# Altium schematic sheet PolarizacionBJT.SchDoc
size A4; SheetNumber: 1; SheetTotal: 1
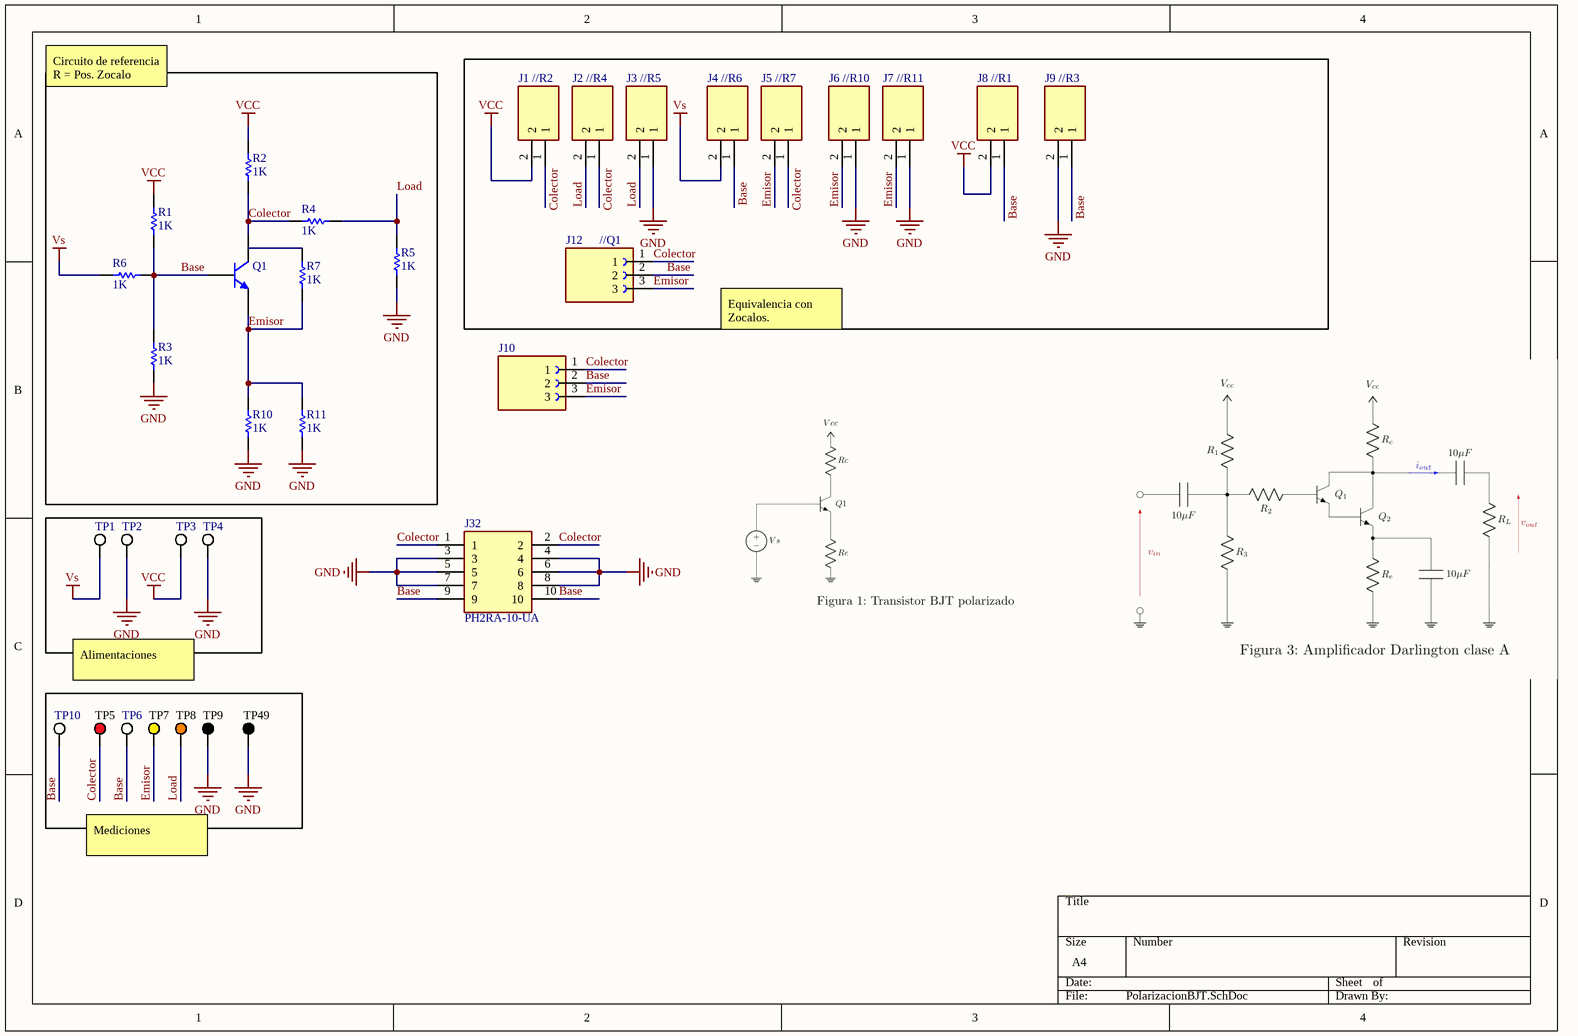
[diagram p0: PolarizacionBJT.SchDoc]

## Parts
J1  D01-9970242  [D019970242]  (value not drawn)
J2  D01-9970242  [D019970242]  (value not drawn)
J3  D01-9970242  [D019970242]  (value not drawn)
J4  D01-9970242  [D019970242]  (value not drawn)
J5  D01-9970242  [D019970242]  (value not drawn)
J6  D01-9970242  [D019970242]  (value not drawn)
J7  D01-9970242  [D019970242]  (value not drawn)
J8  D01-9970242  [D019970242]  (value not drawn)
J9  D01-9970242  [D019970242]  (value not drawn)
J10  D01-9970342  [HARWIN_D01-9970342]  (value not drawn)
J12  D01-9970342  [HARWIN_D01-9970342]  (value not drawn)
J32  PH2RA-10-UA  [HDRRA10W64P254_2X5_1270X250X538P]
Q1  Bipolar NPN 3 Pins Transistor VBIC Model  (value not drawn)
R1  value 1K  (hidden comment: Resistor)
R2  value 1K  (hidden comment: Resistor)
R3  value 1K  (hidden comment: Resistor)
R4  value 1K  (hidden comment: Resistor)
R5  value 1K  (hidden comment: Resistor)
R6  value 1K  (hidden comment: Resistor)
R7  value 1K  (hidden comment: Resistor)
R10  value 1K  (hidden comment: Resistor)
R11  value 1K  (hidden comment: Resistor)
TP1  575-4  [KSTN-575-4]  (value not drawn)
TP2  575-4  [KSTN-575-4]  (value not drawn)
TP3  575-4  [KSTN-575-4]  (value not drawn)
TP4  575-4  [KSTN-575-4]  (value not drawn)
TP5  5010  [KSTN-5010_V]  (value not drawn)
TP6  5012  [KSTN-5012_V]  (value not drawn)
TP7  5014  [KSTN-5014_V]  (value not drawn)
TP8  5013  [KSTN-5013_V]  (value not drawn)
TP9  5011  [KSTN-5011_V]  (value not drawn)
TP10  5012  [KSTN-5012_V]  (value not drawn)
TP49  5011  [KSTN-5011_V]  (value not drawn)

## Nets
GND: J3.1 J6.1 J7.1 J9.2 J32.3 J32.4 J32.5 J32.6 J32.7 J32.8 R3.1 R5.2 R10.2 R11.2 TP2.1 TP4.1 TP9.1 TP49.1
VCC: J1.2 J8.2 R1.2 R2.1 TP3.1
Vs: J4.2 R6.2 TP1.1
Base: J4.1 J8.1 J9.1 J10.2 J12.2 J32.9 J32.10 Q1.2(B) R1.1 R3.2 R6.1 TP6.1 TP10.1
Colector: J1.1 J2.1 J5.1 J10.1 J12.1 J32.1 J32.2 Q1.1(C) R2.2 R4.2 TP5.1
Emisor: J5.2 J6.2 J7.2 J10.3 J12.3 Q1.3(E) R7.2 R10.1 R11.1 TP7.1
Load: J2.2 J3.2 R4.1 R5.1 TP8.1

Not connected (* = marked no-connect by the designer): R7 1

## Notes on the sheet
- Circuito de referencia
  R = Pos. Zocalo
- //R2
- //R4
- //R5
- //R6
- //R7
- //R10
- //R11
- //R1
- //R3
- (near J12) //Q1
- Equivalencia con Zocalos.
- Alimentaciones
- Mediciones

## Library data of the parts
J1-J9 = D01-9970242: IC Socket: 2 Pos Receptacle SIL Straight THT Strip; Manufacturer_Name: Harwin; Geometry.Height: 4.2mm; Mouser Part Number: 855-D01-9970242; Mouser Price/Stock: https://www.mouser.co.uk/ProductDetail/Harwin/D01-9970242?qs=TpUtqFO9vU%252Bf37OJ5TYoTQ%3D%3D; Manufacturer_Part_Number: D01-9970242; Datasheet Link: https://content.harwin.com/m/e0b6c35948424a73/original/DRG-00097-Technical-Drawing-Datasheet-D01-997-pdf.pdf
J32 = PH2RA-10-UA: CONN HEADER R/A 10POS 2.54MM; Manufacturer_Name: Adam Tech; Geometry.Height: 5.381mm; Mouser Part Number: 737-PH2RA-10-UA; Mouser Price/Stock: https://www.mouser.co.uk/ProductDetail/Adam-Tech/PH2RA-10-UA?qs=HoCaDK9Nz5eXic%252Bmj6sc5g%3D%3D; Manufacturer_Part_Number: PH2RA-10-UA; Datasheet Link: https://app.adam-tech.com/products/download/data_sheet/200508/ph2ra-xx-ua-data-sheet.pdf
Q1 = BJT NPN VBIC: SimulationGenericComponent: True; AFN: 1; AJC: -0.5; ART: 0.1; AVC1: 0; EA: 1.12; FC: 0.9; IBBE: 1e-06; IBCI: 1e-16; IBEI: 1e-18; MC: 0.33; NCN: 2; NKF: 0.5; PC: 0.75; TNOM: 27; VERS: 1.2; XII: 3; AJE: -0.5; AJS: -0.5; AVC2: 0; BFN: 1; CBCO: 0; CBEO: 0; CCSO: 0; CJC: 0; CJCP: 0; CJE: 0; CJEP: 0; CTH: 0; DEAR: 0; EAIC: 1.12; EAIE: 1.12; EAIS: 1.12; EANC: 1.12; EANE: 1.12; EANS: 1.12; EAP: 1.12; EBBE: 0; GAMM: 0; HRCF: 1; IBCIP: 0; IBCN: 0; IBCNP: 0; IBEIP: 0; IBEN: 0; IBENP: 0; IKF: 0; IKP: 0; IKR: 0; IS: 1e-16; ISP: 0; ISRR: 1; ITF: 0; KFN: 0; ME: 0.33; MS: 0.33; NBBE: 1; NCI: 1; NCIP: 1; NCNP: 2; NEI: 1; NEN: 2; NF: 1; NFP: 1; NR: 1; PE: 0.75; PS: 0.75; QBM: 0; QCO: 0; QTF: 0; RBI: 0.1; RBP: 0.1; RBX: 0; RCI: 0.1; RCX: 0; RE: 0; RS: 0; RTH: 0; TAVC: 0; TD: 0; TF: 0; TNBBE: 0; TNF: 0; TR: 0; TVBBE1: 0; TVBBE2: 0; VBBE: 0; VEF: 0; VER: 0; VO: 0; VREF: 0; VRT: 0; VTF: 0; WBE: 1; WSP: 1; XIKF: 0; XIN: 3; XIS: 3; XISR: 0; XRBI: 0; XRBP: 0; XRBX: 0; XRCI: 0; XRCX: 0; XRE: 0; XRS: 0; XTF: 0; XVO: 0
R1-R7 R10 R11 = Resistor: TC1: 0; SimulationGenericComponent: True; TC2: 0
TP1-TP4 = CMP-2000-05649-1: Banana Jack, Non-Insulated, 1-Pin THD, RoHS, Bulk; Manufacturer: Keystone-Electronics; Package Version: Rev. B, 11/1994; Plug/Mating Plug Diameter: StandardBanana; Gender: Female; Package Reference: 575-4; Operating Temperature: -; Contact Material: Brass; Packaging: Bulk; Series: -; Category: Connectors,Interconnects; Color: -; Type: BananaJack; Contact Finish: Nickel; Features: -; Family: BananaandTipConnectors-Jacks,Plugs; Body Material: -; Manufacturer URL: http://www.keyelco.com/; Termination: Solder; Insulation: Non-Insulated; Datasheet Version: Rev. B, 11/1994; Mounting Technology: ThroughHole; Package URL: http://www.keyelco.com/product-pdf.cfm?p=2379; Mounting Type: ThroughHole; Package Description: 1-Pin Through Hole Device, Dia 7.92 mm; Datasheet URL: http://www.keyelco.com/product-pdf.cfm?p=2379; Wire Gauge: -
TP5 = CMP-1672-00002-4: Test Point, Red, Through Hole, RoHS, Bulk; Manufacturer: Keystone; Contact Material: Bronze; Mounting Technology: Through Hole; RoHSCompliant: true; Pins: 1; Package Quantity: 100; ComponentLink2Description: Datasheet; Height: 8.12 mm; ComponentLink1URL: http://www.keyelco.com/; DatasheetVersion: Rev. F, 12/2013; Mount: Through Hole; PackageReference: 5010; Contact Plating: Silver; Packaging: Bulk; Colour: Red; REACH SVHC: No SVHC; PackageDescription: 1-Pin Through Hole Device, Dia 3.17 mm; ComponentLink2URL: http://www.keyelco.com/product-pdf.cfm?p=1319; ComponentLink1Description: Manufacturer URL
TP6 TP10 = CMP-1672-00004-4: Test Point, White, Through Hole, RoHS, Bulk; Manufacturer: Keystone; DatasheetVersion: Rev. F, 12/2013; ComponentLink1URL: http://www.keyelco.com/; PackageReference: 5012; RoHSCompliant: true; ComponentLink2Description: Datasheet; Colour: White; Contact Material: Bronze; PackageDescription: 1-Pin Through Hole Device, Dia 3.17 mm; Mounting Technology: Through Hole; Mount: Through Hole; Package Quantity: 100; ComponentLink1Description: Manufacturer URL; Pins: 1; Height: 8.12 mm; Packaging: Bulk; REACH SVHC: No SVHC; Contact Plating: Silver; Length: 11.3 mm; ComponentLink2URL: http://www.keyelco.com/product-pdf.cfm?p=1321
TP7 = CMP-1672-00006-4: Test Point, Yellow, Through Hole, RoHS, Bulk; Manufacturer: Keystone; PackageDescription: 1-Pin Through Hole Device, Dia 3.17 mm; REACH SVHC: No SVHC; ComponentLink2Description: Datasheet; ComponentLink2URL: http://www.keyelco.com/product-pdf.cfm?p=1323; Package Quantity: 100; Colour: Yellow; Height: 8.12 mm; RoHSCompliant: true; Contact Material: Bronze; Mount: Through Hole; Contact Plating: Silver; ComponentLink1URL: http://www.keyelco.com/; Packaging: Bulk; Mounting Technology: Through Hole; PackageReference: 5014; ComponentLink1Description: Manufacturer URL; DatasheetVersion: Rev. F, 12/2013
TP8 = CMP-1672-00005-4: Test Point, Orange, Through Hole, RoHS, Bulk; Manufacturer: Keystone; REACH SVHC: No SVHC; ComponentLink2Description: Datasheet; PackageDescription: 1-Pin Through Hole Device, Dia 3.17 mm; Package Quantity: 100; PackageReference: 5013; Contact Material: Bronze; DatasheetVersion: Rev. F, 12/2013; ComponentLink2URL: http://www.keyelco.com/product-pdf.cfm?p=1322; Contact Plating: Silver; ComponentLink1URL: http://www.keyelco.com/; Packaging: Bulk; ComponentLink1Description: Manufacturer URL; Colour: Orange; Height: 8.12 mm; RoHSCompliant: True; Mount: Through Hole; Mounting Technology: Through Hole
TP9 TP49 = CMP-1672-00003-4: Test Point, Black, Through Hole, RoHS, Bulk; Manufacturer: Keystone; ComponentLink2URL: http://www.keyelco.com/product-pdf.cfm?p=1320; Colour: Black; Pins: 1; REACH SVHC: No SVHC; ComponentLink1URL: http://www.keyelco.com/; PackageReference: 5011; Contact Plating: Silver; Package Quantity: 100; Packaging: Bulk; RoHSCompliant: true; Height: 8.12 mm; PackageDescription: 1-Pin Through Hole Device, Dia 3.17 mm; Mount: Through Hole; Mounting Technology: Through Hole; DatasheetVersion: Rev. F, 12/2013; ComponentLink1Description: Manufacturer URL; Contact Material: Bronze; ComponentLink2Description: Datasheet
J10 J12 = D01-9970342: Package: None; Price: None; Value: *; MP: D01-9970342; Availability: Unavailable